# EasyEDA Pro project ProProject_2024电赛备赛清单_Wang01_2024-08-05.epro, schematic Schematic8

## Sheets
1 P1加法器电路: Create Date: 2024-07-20; Page Name: P1; Project Name: 2024电赛备赛清单_Wang01; Schematic Name: Schematic8; Update Date: 2024-07-20; Company: 嘉立创EDA; Page Size: A4; Version: V1.0
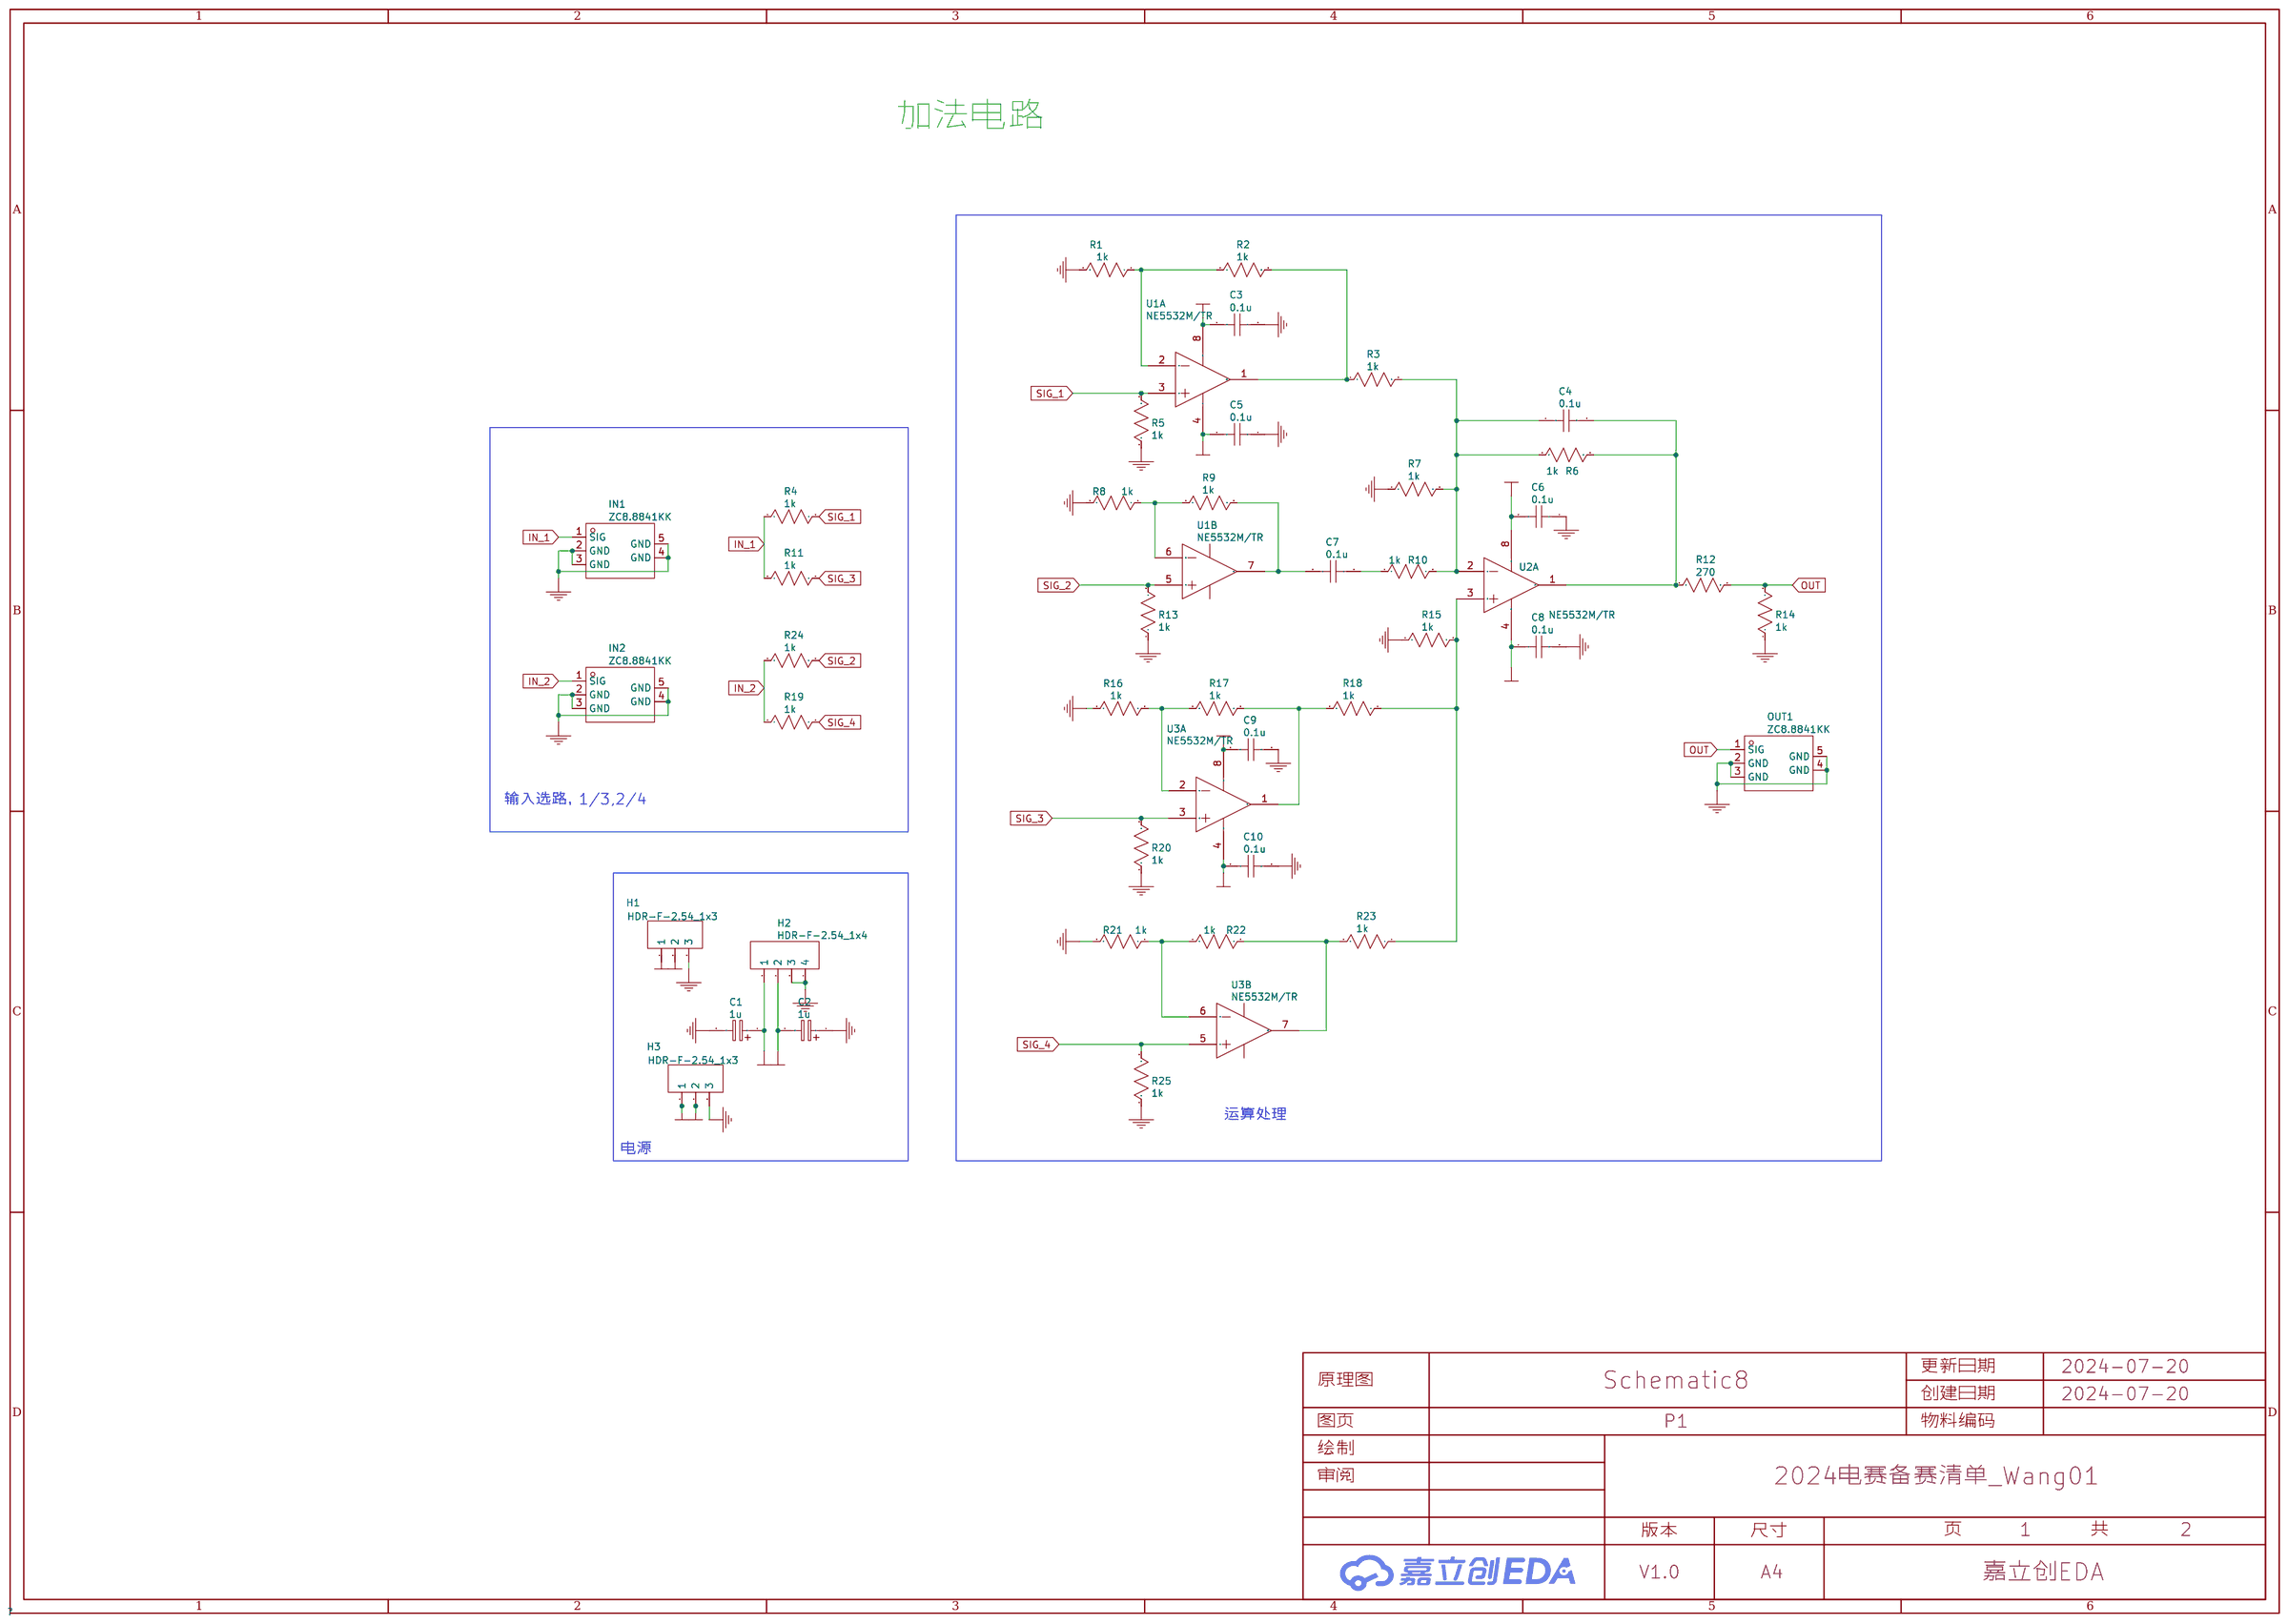
[diagram p7: P1加法器电路]
2 P2比较器电路: Page Name: P2
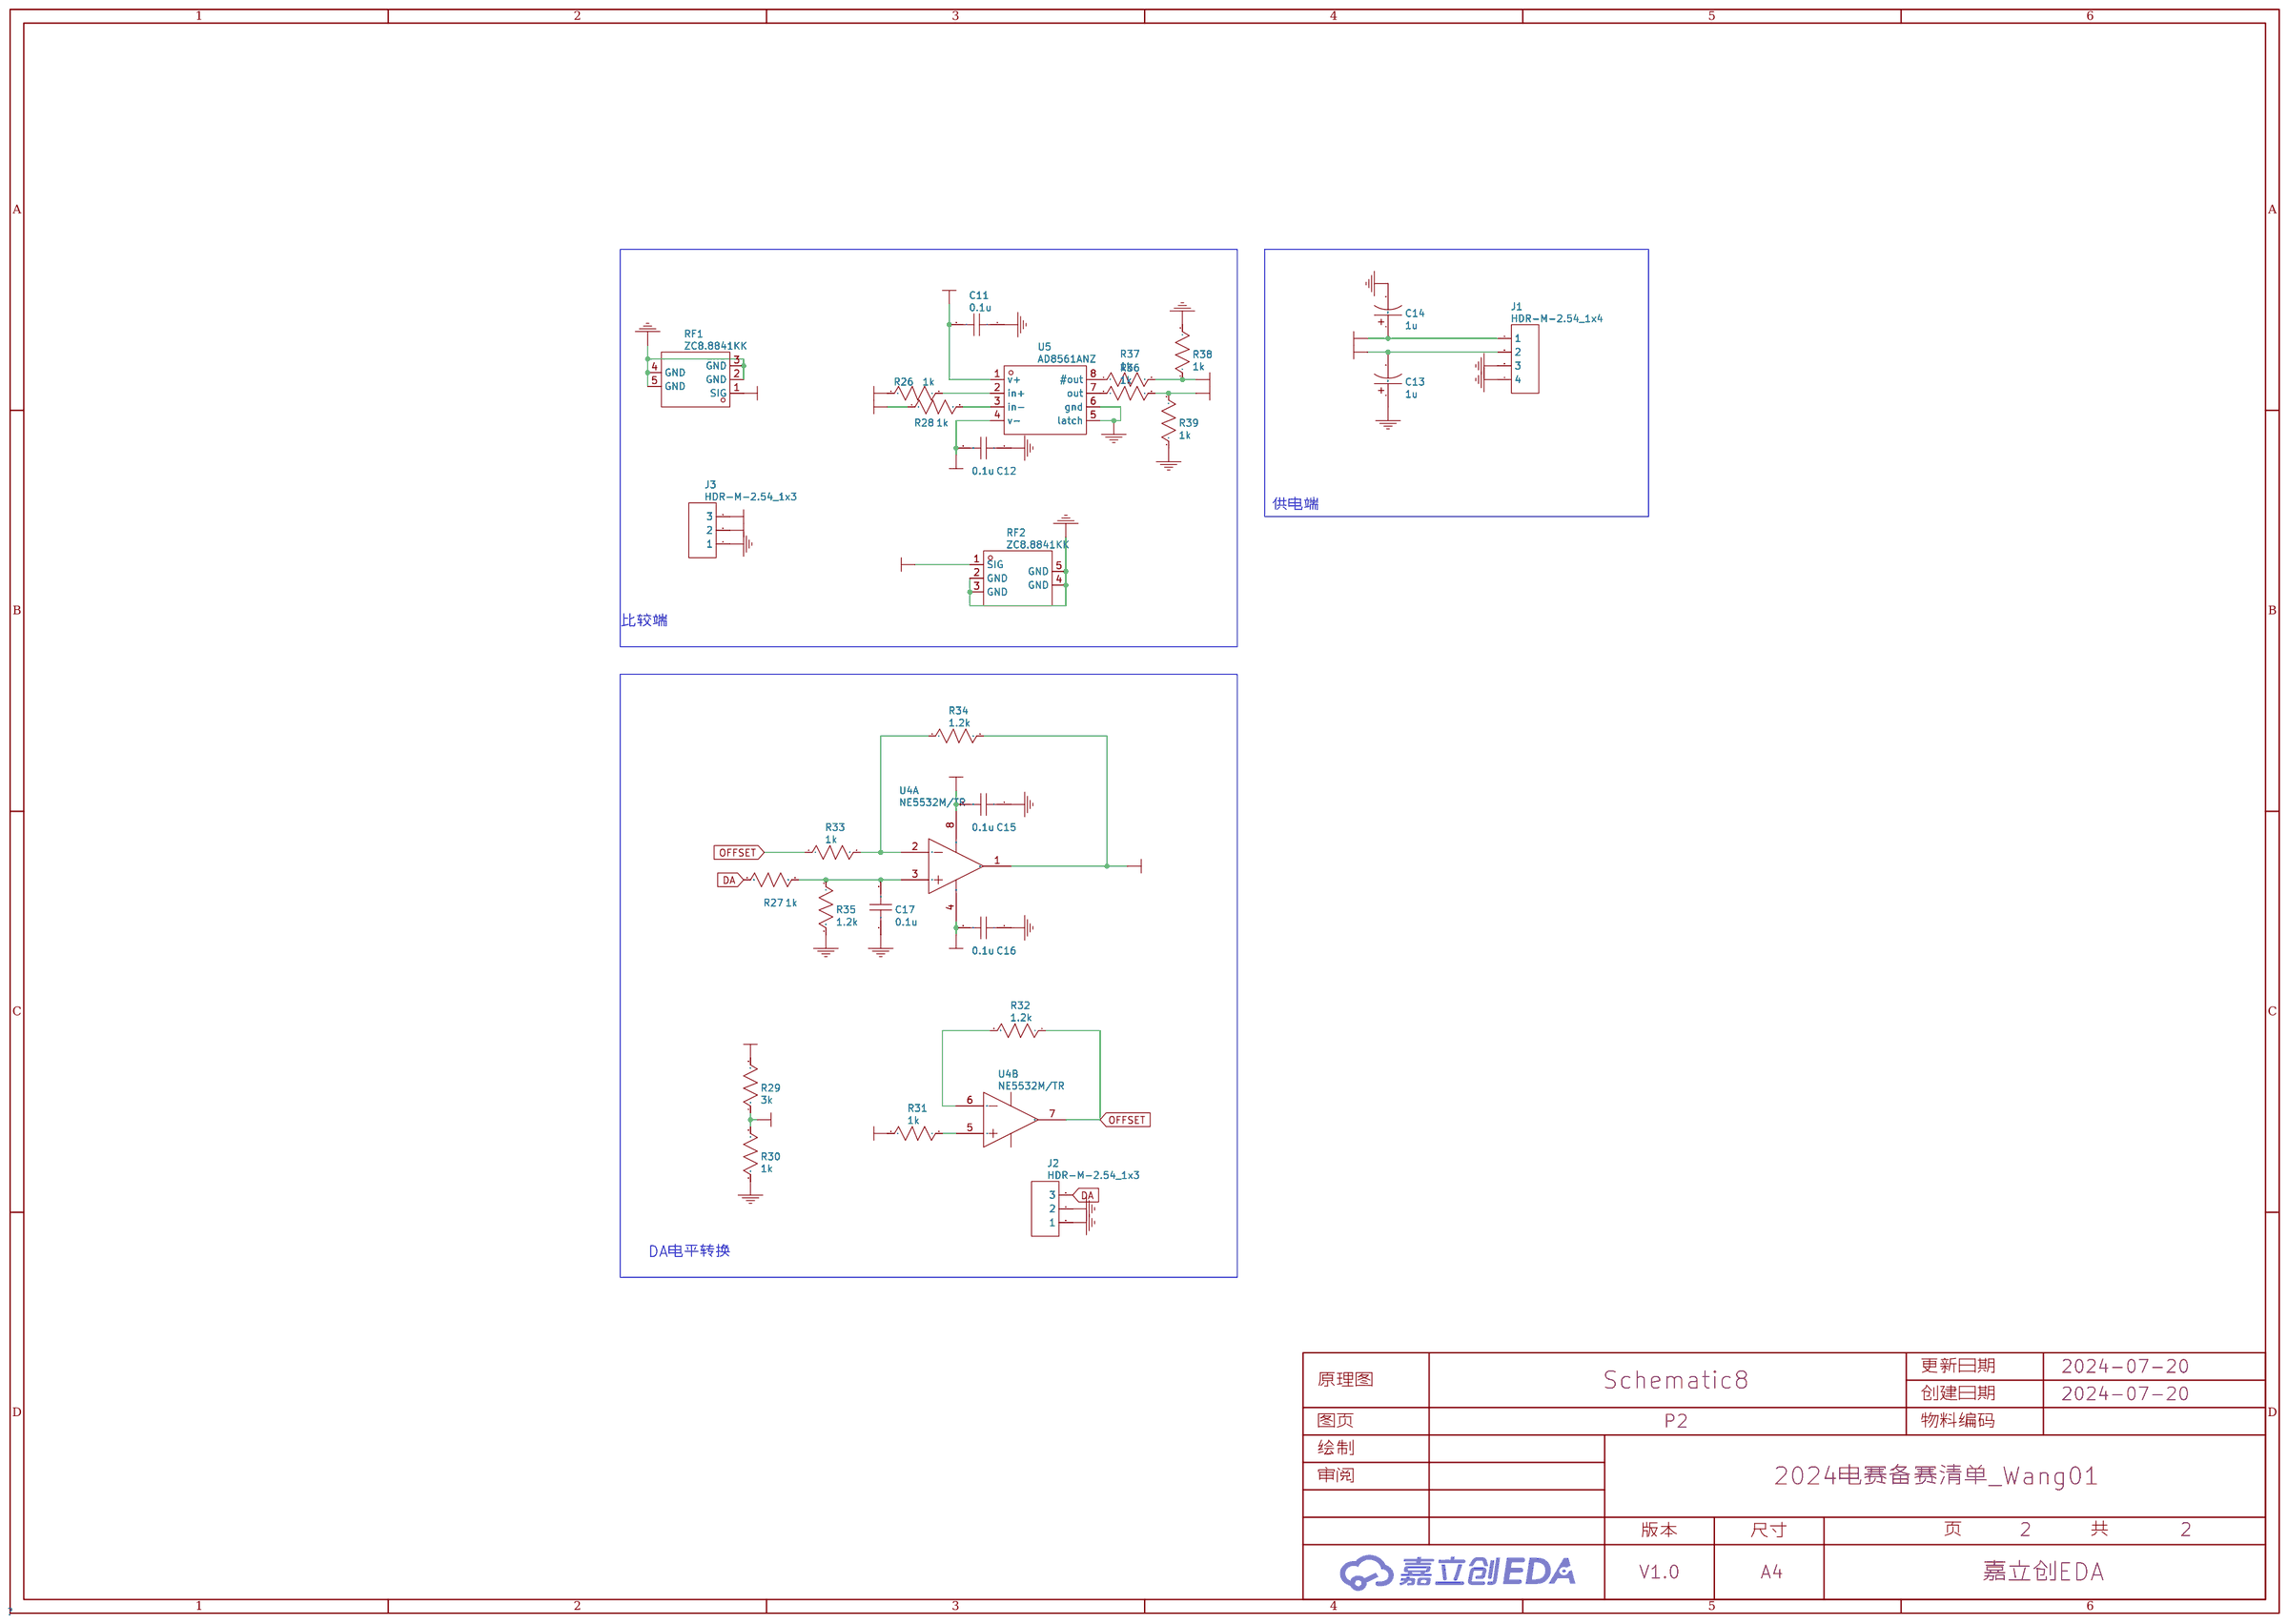
[diagram p8: P2比较器电路]

## Parts
sheet P1加法器电路
C1  1u  [CASE-A_3216]
C2  1u  [CASE-A_3216]
C3  0.1u  [C0805]
C4  0.1u  [C0805]
C5  0.1u  [C0805]
C6  0.1u  [C0805]
C7  0.1u  [C0805]
C8  0.1u  [C0805]
C9  0.1u  [C0805]
C10  0.1u  [C0805]
H1  HDR-F-2.54_1x3  [HDR-F-2.54_1X3]
H2  HDR-F-2.54_1x4  [HDR-F-2.54_1X4]
H3  HDR-F-2.54_1x3  [HDR-F-2.54_1X3]
IN1  ZC8.8841KK  [SMA-SMD_ZC8.8841KK]
IN2  ZC8.8841KK  [SMA-SMD_ZC8.8841KK]
OUT1  ZC8.8841KK  [SMA-SMD_ZC8.8841KK]
R1  1k  [R0805]
R2  1k  [R0805]
R3  1k  [R0805]
R4  1k  [R0805]
R5  1k  [R0805]
R6  1k  [R0805]
R7  1k  [R0805]
R8  1k  [R0805]
R9  1k  [R0805]
R10  1k  [R0805]
R11  1k  [R0805]
R12  270  [R0805]
R13  1k  [R0805]
R14  1k  [R0805]
R15  1k  [R0805]
R16  1k  [R0805]
R17  1k  [R0805]
R18  1k  [R0805]
R19  1k  [R0805]
R20  1k  [R0805]
R21  1k  [R0805]
R22  1k  [R0805]
R23  1k  [R0805]
R24  1k  [R0805]
R25  1k  [R0805]
U1  NE5532M/TR  [SOP-8_L4.9-W3.9-P1.27-LS6.0-BL]  (sections 1,2)
U2  NE5532M/TR  [SOP-8_L4.9-W3.9-P1.27-LS6.0-BL]  (section 1)
U3  NE5532M/TR  [SOP-8_L4.9-W3.9-P1.27-LS6.0-BL]  (sections 1,2)
sheet P2比较器电路
C11  0.1u  [C0805]
C12  0.1u  [C0805]
C13  1u  [CASE-A_3216]
C14  1u  [CASE-A_3216]
C15  0.1u  [C0805]
C16  0.1u  [C0805]
C17  0.1u  [C0805]
J1  HDR-M-2.54_1x4  [HDR-M-2.54_1X4]
J2  HDR-M-2.54_1x3  [HDR-M-2.54_1X3]
J3  HDR-M-2.54_1x3  [HDR-M-2.54_1X3]
R26  1k  [R0805]
R27  1k  [R0805]
R28  1k  [R0805]
R29  3k  [R0805]
R30  1k  [R0805]
R31  1k  [R0805]
R32  1.2k  [R0805]
R33  1k  [R0805]
R34  1.2k  [R0805]
R35  1.2k  [R0805]
R36  1k  [R0805]
R37  1k  [R0805]
R38  1k  [R0805]
R39  1k  [R0805]
RF1  ZC8.8841KK  [SMA-SMD_ZC8.8841KK]
RF2  ZC8.8841KK  [SMA-SMD_ZC8.8841KK]
U4  NE5532M/TR  [SOP-8_L4.9-W3.9-P1.27-LS6.0-BL]  (sections 1,2)
U5  AD8561ANZ  [DIP-8_L9.8-W6.6-P2.54-LS7.6-BL]

## Library data of the parts
C1 C2 C13 C14 = 1u
C3-C12 C15-C17 = 0.1u
H1 H3 = HDR-F-2.54_1x3: Supplier Part: C146690; Supplier: LCSC
H2 = HDR-F-2.54_1x4: Supplier Part: C225501; Supplier: LCSC
IN1 IN2 OUT1 RF1 RF2 = ZC8.8841KK: Supplier: LCSC; Supplier Part: C976230; Manufacturer: 众驰电子; JLCPCB Part Class: Extended Part
R1-R11 R13-R28 R30 R31 R33 R36-R39 = 1k
R12 = 270
U1 U2 U4 = NE5532M/TR: Supplier: LCSC; Supplier Part: C434481; Manufacturer: HGSEMI; JLCPCB Part Class: Extended Part
U3 = NE5532M/TR: Supplier: LCSC; Supplier Part: C434481; Manufacturer: HGSEMI(华冠); JLCPCB Part Class: Extended Part
J1 = HDR-M-2.54_1x4: Supplier Part: C124378; Supplier: LCSC
J2 J3 = HDR-M-2.54_1x3: Supplier Part: C180248; Supplier: LCSC
R29 = 3k
R32 R34 R35 = 1.2k
U5 = AD8561ANZ: Supplier: LCSC; Supplier Part: C208619; Manufacturer: Analog Devices; JLCPCB Part Class: Extended Part

## Nets
1.25V: R29.1 R30.2 R31.2
+5V: C1.1 C3.1 C6.2 C9.2 C11.2 C14.1 C15.2 H1.1 H2.1 H3.1 J1.1 R29.2 U1.8(VCC+) U2.8(VCC+) U3.8(VCC+) U4.8(VCC+) U5.1(v+)
-5V: C2.2 C5.2 C8.1 C10.1 C12.2 C13.2 C16.2 H1.2 H2.2 H3.2 J1.2 U1.4(VCC-) U2.4(VCC-) U3.4(VCC-) U4.4(VCC-) U5.4(v-)
GND: C1.2 C2.1 C3.2 C5.1 C6.1 C8.2 C9.1 C10.2 C11.1 C12.1 C13.1 C14.2 C15.1 C16.1 C17.1 H1.3 H2.3 H2.4 H3.3 IN1.2(GND) IN1.3(GND) IN1.4(GND) IN1.5(GND) IN2.2(GND) IN2.3(GND) IN2.4(GND) IN2.5(GND) J1.3 J1.4 J2.1 J2.2 J3.1 OUT1.2(GND) OUT1.3(GND) OUT1.4(GND) OUT1.5(GND) R1.2 R5.1 R7.1 R8.2 R13.1 R14.1 R15.1 R16.2 R20.1 R21.2 R25.1 R30.1 R35.2 R38.2 R39.1 RF1.2(GND) RF1.3(GND) RF1.4(GND) RF1.5(GND) RF2.2(GND) RF2.3(GND) RF2.4(GND) RF2.5(GND) U5.5(latch) U5.6(gnd)
-OUT: J3.3 R37.2 R38.1
COM: R28.1 R34.2 U4.1(OUT1)
DA: J2.3 R27.2
IN_1: IN1.1(SIG) R4.1 R11.1
IN_2: IN2.1(SIG) R19.1 R24.1
OFFSET: R32.1 R33.1 U4.7(OUT2)
OUT: J3.2 OUT1.1(SIG) R12.2 R14.2 R36.2 R39.2 RF2.1(SIG)
SIG: R26.1 RF1.1(SIG)
SIG_1: R4.2 R5.2 U1.3(IN1+)
SIG_2: R13.2 R24.2 U1.5(IN2+)
SIG_3: R11.2 R20.2 U3.3(IN1+)
SIG_4: R19.2 R25.2 U3.5(IN2+)
C4_1: C4.1 R3.2 R6.1 R7.2 R10.2 U2.2(IN1-)
C4_2: C4.2 R6.2 R12.1 U2.1(OUT1)
Net-(C17-2): C17.2 R27.1 R35.1 U4.3(IN1+)
Net-(R26-2): R26.2 U5.2(in+)
Net-(R28-2): R28.2 U5.3(in-)
Net-(R31-1): R31.1 U4.5(IN2+)
Net-(R32-2): R32.2 U4.6(IN2-)
Net-(R33-2): R33.2 R34.1 U4.2(IN1-)
Net-(R36-1): R36.1 U5.7(out)
Net-(R37-1): R37.1 U5.8(#out)
R3_1: R2.2 R3.1 U1.1(OUT1)
R10_1: C7.2 R10.1
U1_2: R1.1 R2.1 U1.2(IN1-)
U1_6: R8.1 R9.1 U1.6(IN2-)
U1_7: C7.1 R9.2 U1.7(OUT2)
U2_3: R15.2 R18.1 R23.1 U2.3(IN1+)
U3_1: R17.2 R18.2 U3.1(OUT1)
U3_2: R16.1 R17.1 U3.2(IN1-)
U3_6: R21.1 R22.1 U3.6(IN2-)
U3_7: R22.2 R23.2 U3.7(OUT2)

## Notes on the sheets
sheet 1
- 加法电路
- 输入选路，1/3,2/4
- 运算处理
- 电源
sheet 2
- 供电端
- 比较端
- DA电平转换
